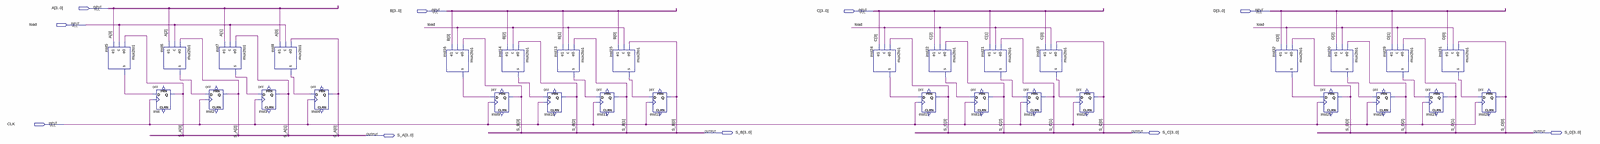
[diagram p0: schematic sheet, whole]
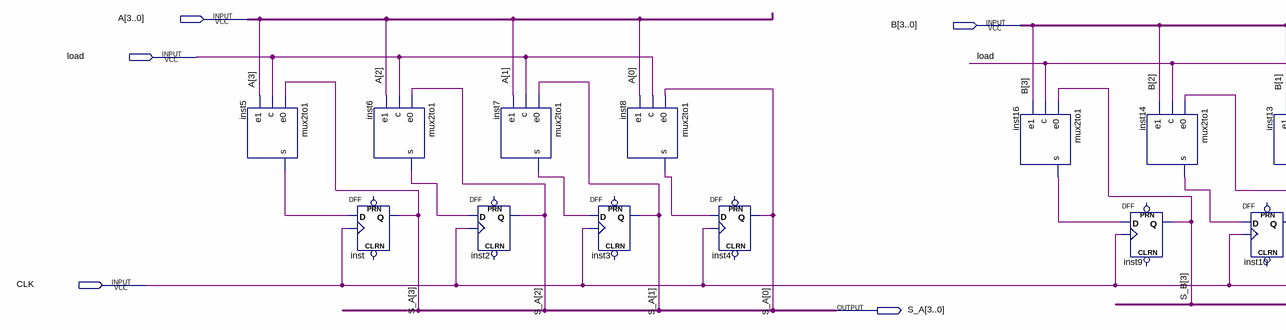
[diagram p1: schematic sheet, left part]
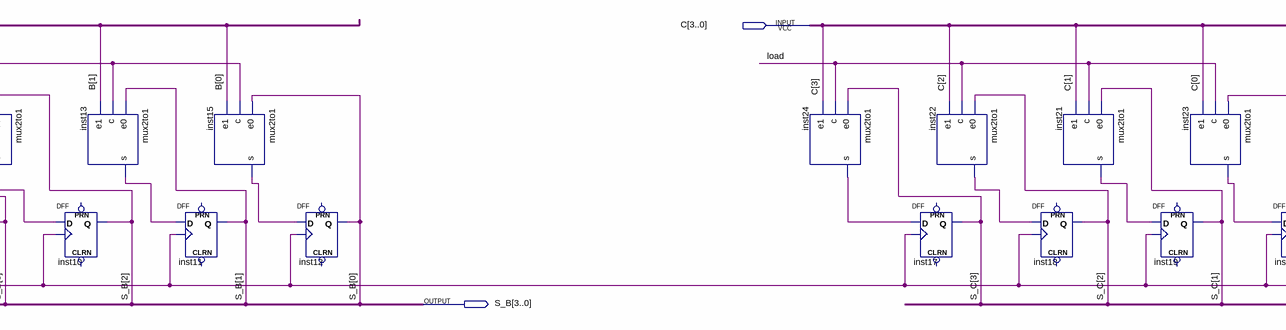
[diagram p2: schematic sheet, centre part]
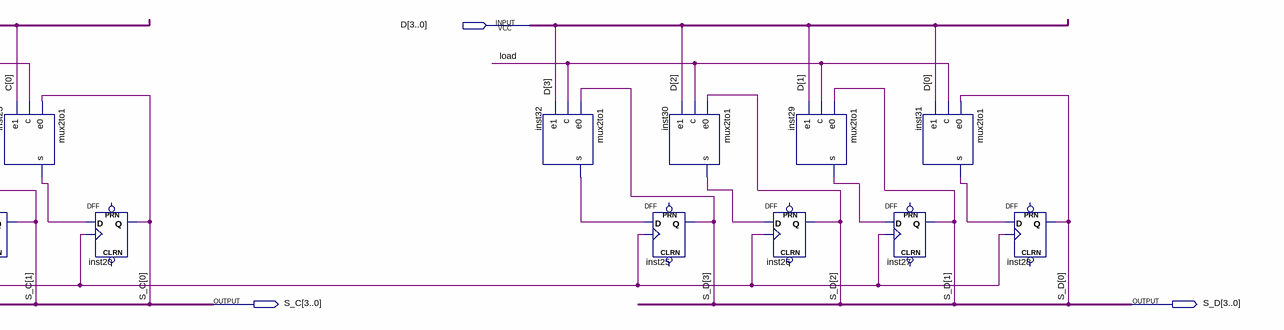
[diagram p3: schematic sheet, right part]
// Quartus schematic reg16bits.bdf as structural Verilog: 32 symbols, 10 pins
module reg16bits (
  input  [3:0] A,
  input  [3:0] B,
  input  [3:0] C,
  input  [3:0] D,
  input  load,
  input  CLK,
  output [3:0] S_B,
  output [3:0] S_C,
  output [3:0] S_D,
  output [3:0] S_A
);

  wire inst5_s, inst6_s, inst7_s, inst8_s, inst13_s, inst14_s, inst15_s, inst16_s, inst21_s, inst22_s,
       inst23_s, inst24_s, inst29_s, inst30_s, inst31_s, inst32_s;

  mux2to1 inst5 (.e0(S_A[3]), .c(load), .e1(A[3]), .s(inst5_s));
  DFF inst (.CLK(CLK), .D(inst5_s), .Q(S_A[3]));  // open: CLRN, PRN
  mux2to1 inst6 (.e0(S_A[2]), .c(load), .e1(A[2]), .s(inst6_s));
  mux2to1 inst7 (.e0(S_A[1]), .c(load), .e1(A[1]), .s(inst7_s));
  DFF inst2 (.CLK(CLK), .D(inst6_s), .Q(S_A[2]));  // open: CLRN, PRN
  DFF inst3 (.CLK(CLK), .D(inst7_s), .Q(S_A[1]));  // open: CLRN, PRN
  mux2to1 inst8 (.e0(S_A[0]), .c(load), .e1(A[0]), .s(inst8_s));
  DFF inst4 (.CLK(CLK), .D(inst8_s), .Q(S_A[0]));  // open: CLRN, PRN
  mux2to1 inst16 (.e0(S_B[3]), .c(load), .e1(B[3]), .s(inst16_s));
  mux2to1 inst14 (.e0(S_B[2]), .c(load), .e1(B[2]), .s(inst14_s));
  DFF inst9 (.CLK(CLK), .D(inst16_s), .Q(S_B[3]));  // open: CLRN, PRN
  mux2to1 inst13 (.e0(S_B[1]), .c(load), .e1(B[1]), .s(inst13_s));
  DFF inst10 (.CLK(CLK), .D(inst14_s), .Q(S_B[2]));  // open: CLRN, PRN
  DFF inst11 (.CLK(CLK), .D(inst13_s), .Q(S_B[1]));  // open: CLRN, PRN
  mux2to1 inst15 (.e0(S_B[0]), .c(load), .e1(B[0]), .s(inst15_s));
  DFF inst12 (.CLK(CLK), .D(inst15_s), .Q(S_B[0]));  // open: CLRN, PRN
  mux2to1 inst24 (.e0(S_C[3]), .c(load), .e1(C[3]), .s(inst24_s));
  mux2to1 inst22 (.e0(S_C[2]), .c(load), .e1(C[2]), .s(inst22_s));
  DFF inst17 (.CLK(CLK), .D(inst24_s), .Q(S_C[3]));  // open: CLRN, PRN
  DFF inst18 (.CLK(CLK), .D(inst22_s), .Q(S_C[2]));  // open: CLRN, PRN
  mux2to1 inst21 (.e0(S_C[1]), .c(load), .e1(C[1]), .s(inst21_s));
  mux2to1 inst23 (.e0(S_C[0]), .c(load), .e1(C[0]), .s(inst23_s));
  DFF inst19 (.CLK(CLK), .D(inst21_s), .Q(S_C[1]));  // open: CLRN, PRN
  DFF inst20 (.CLK(CLK), .D(inst23_s), .Q(S_C[0]));  // open: CLRN, PRN
  mux2to1 inst32 (.e0(S_D[3]), .c(load), .e1(D[3]), .s(inst32_s));
  mux2to1 inst30 (.e0(S_D[2]), .c(load), .e1(D[2]), .s(inst30_s));
  DFF inst25 (.CLK(CLK), .D(inst32_s), .Q(S_D[3]));  // open: CLRN, PRN
  DFF inst26 (.CLK(CLK), .D(inst30_s), .Q(S_D[2]));  // open: CLRN, PRN
  mux2to1 inst29 (.e0(S_D[1]), .c(load), .e1(D[1]), .s(inst29_s));
  mux2to1 inst31 (.e0(S_D[0]), .c(load), .e1(D[0]), .s(inst31_s));
  DFF inst27 (.CLK(CLK), .D(inst29_s), .Q(S_D[1]));  // open: CLRN, PRN
  DFF inst28 (.CLK(CLK), .D(inst31_s), .Q(S_D[0]));  // open: CLRN, PRN
endmodule
